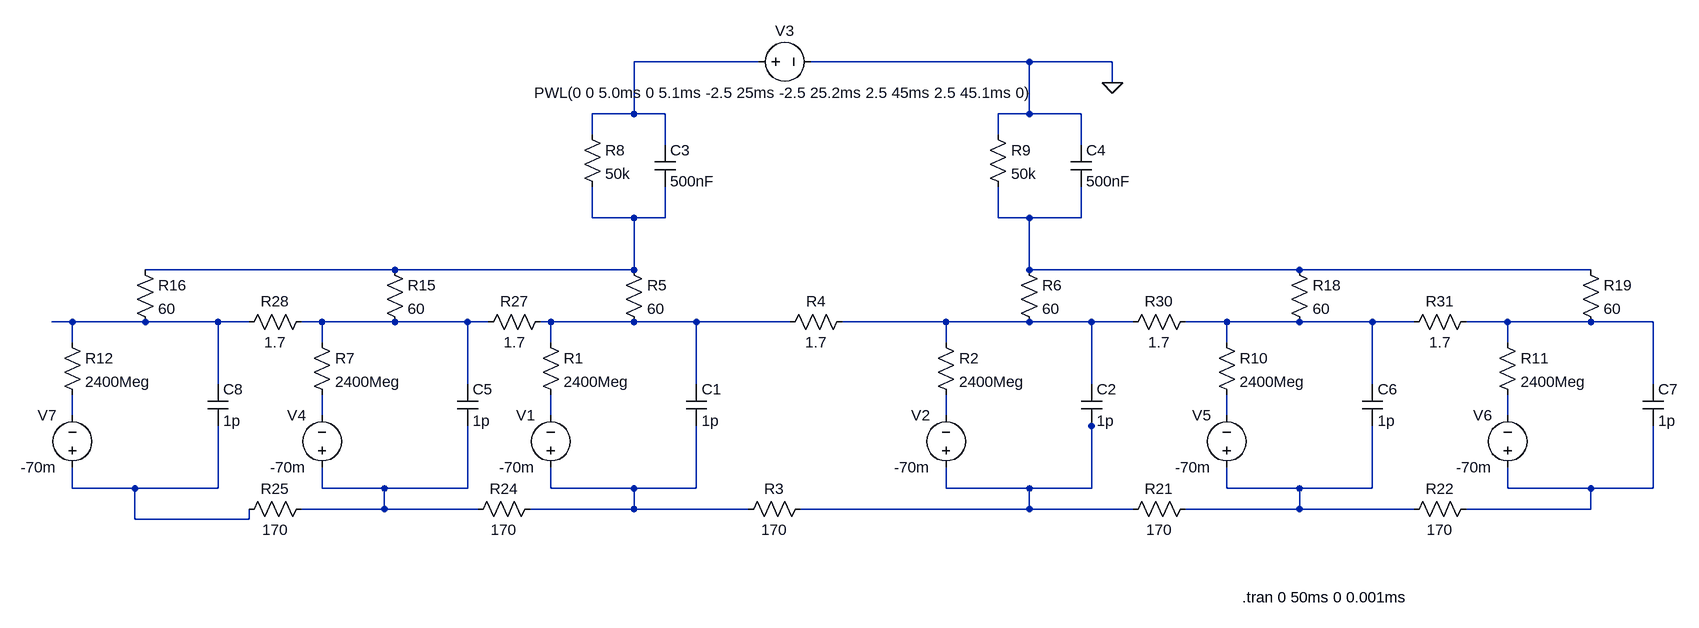
[diagram p0: schematic 電圧刺激等価回路_20200529.asc]
電圧刺激等価回路_20200529.asc, the LTspice schematic file:
Version 4
SHEET 1 2136 680
WIRE 320 -368 128 -368
WIRE 736 -368 400 -368
WIRE 864 -368 736 -368
WIRE 864 -336 864 -368
WIRE 128 -288 128 -368
WIRE 128 -288 64 -288
WIRE 176 -288 128 -288
WIRE 736 -288 736 -368
WIRE 736 -288 688 -288
WIRE 816 -288 736 -288
WIRE 64 -256 64 -288
WIRE 688 -256 688 -288
WIRE 176 -240 176 -288
WIRE 816 -240 816 -288
WIRE 64 -128 64 -176
WIRE 128 -128 64 -128
WIRE 176 -128 176 -176
WIRE 176 -128 128 -128
WIRE 688 -128 688 -176
WIRE 736 -128 688 -128
WIRE 816 -128 816 -176
WIRE 816 -128 736 -128
WIRE -240 -48 -624 -48
WIRE 128 -48 128 -128
WIRE 128 -48 -240 -48
WIRE 736 -48 736 -128
WIRE 1152 -48 736 -48
WIRE 1600 -48 1152 -48
WIRE -736 32 -768 32
WIRE -624 32 -736 32
WIRE -512 32 -624 32
WIRE -464 32 -512 32
WIRE -352 32 -384 32
WIRE -240 32 -352 32
WIRE -128 32 -240 32
WIRE -96 32 -128 32
WIRE 0 32 -16 32
WIRE 128 32 0 32
WIRE 224 32 128 32
WIRE 368 32 224 32
WIRE 608 32 448 32
WIRE 736 32 608 32
WIRE 832 32 736 32
WIRE 896 32 832 32
WIRE 1040 32 976 32
WIRE 1152 32 1040 32
WIRE 1264 32 1152 32
WIRE 1328 32 1264 32
WIRE 1472 32 1408 32
WIRE 1600 32 1472 32
WIRE 1696 32 1600 32
WIRE -736 64 -736 32
WIRE -352 64 -352 32
WIRE 0 64 0 32
WIRE 608 64 608 32
WIRE 1040 64 1040 32
WIRE 1472 64 1472 32
WIRE -512 128 -512 32
WIRE -128 128 -128 32
WIRE 224 128 224 32
WIRE 832 128 832 32
WIRE 1264 128 1264 32
WIRE 1696 128 1696 32
WIRE -736 176 -736 144
WIRE -352 176 -352 144
WIRE 0 176 0 144
WIRE 608 176 608 144
WIRE 1040 176 1040 144
WIRE 1472 176 1472 144
WIRE 832 192 832 176
WIRE -736 288 -736 256
WIRE -640 288 -736 288
WIRE -512 288 -512 192
WIRE -512 288 -640 288
WIRE -352 288 -352 256
WIRE -256 288 -352 288
WIRE -128 288 -128 192
WIRE -128 288 -256 288
WIRE 0 288 0 256
WIRE 128 288 0 288
WIRE 224 288 224 192
WIRE 224 288 128 288
WIRE 608 288 608 256
WIRE 736 288 608 288
WIRE 832 288 832 192
WIRE 832 288 736 288
WIRE 1040 288 1040 256
WIRE 1152 288 1040 288
WIRE 1264 288 1264 192
WIRE 1264 288 1152 288
WIRE 1472 288 1472 256
WIRE 1600 288 1472 288
WIRE 1696 288 1696 192
WIRE 1696 288 1600 288
WIRE -256 320 -256 288
WIRE -256 320 -384 320
WIRE -112 320 -256 320
WIRE 128 320 128 288
WIRE 128 320 -32 320
WIRE 304 320 128 320
WIRE 736 320 736 288
WIRE 736 320 384 320
WIRE 896 320 736 320
WIRE 1152 320 1152 288
WIRE 1152 320 976 320
WIRE 1328 320 1152 320
WIRE 1600 320 1600 288
WIRE 1600 320 1408 320
WIRE -640 336 -640 288
WIRE -464 336 -464 320
WIRE -464 336 -640 336
FLAG 864 -336 0
SYMBOL voltage 304 -368 R270
WINDOW 0 32 56 VTop 2
WINDOW 3 -32 56 VBottom 2
WINDOW 123 0 0 Left 0
WINDOW 39 0 0 Left 0
SYMATTR InstName V3
SYMATTR Value PWL(0 0 5.0ms 0 5.1ms -2.5 25ms -2.5 25.2ms 2.5 45ms 2.5 45.1ms 0)
SYMBOL res -16 48 R0
SYMATTR InstName R1
SYMATTR Value 2400Meg
SYMBOL res 592 48 R0
SYMATTR InstName R2
SYMATTR Value 2400Meg
SYMBOL res 400 304 R90
WINDOW 0 0 56 VBottom 2
WINDOW 3 32 56 VTop 2
SYMATTR InstName R3
SYMATTR Value 170
SYMBOL res 112 -64 R0
SYMATTR InstName R5
SYMATTR Value 60
SYMBOL res 720 -64 R0
SYMATTR InstName R6
SYMATTR Value 60
SYMBOL cap 208 128 R0
SYMATTR InstName C1
SYMATTR Value 1p
SYMBOL cap 816 128 R0
SYMATTR InstName C2
SYMATTR Value 1p
SYMBOL cap 160 -240 R0
SYMATTR InstName C3
SYMATTR Value 500nF
SYMBOL cap 800 -240 R0
SYMATTR InstName C4
SYMATTR Value 500nF
SYMBOL res 48 -272 R0
SYMATTR InstName R8
SYMATTR Value 50k
SYMBOL res 672 -272 R0
SYMATTR InstName R9
SYMATTR Value 50k
SYMBOL voltage 0 272 R180
WINDOW 0 24 96 Left 2
WINDOW 3 24 16 Left 2
SYMATTR InstName V1
SYMATTR Value -70m
SYMBOL voltage 608 272 R180
WINDOW 0 24 96 Left 2
WINDOW 3 24 16 Left 2
SYMATTR InstName V2
SYMATTR Value -70m
SYMBOL res 464 16 R90
WINDOW 0 0 56 VBottom 2
WINDOW 3 32 56 VTop 2
SYMATTR InstName R4
SYMATTR Value 1.7
SYMBOL res -368 48 R0
SYMATTR InstName R7
SYMATTR Value 2400Meg
SYMBOL cap -144 128 R0
SYMATTR InstName C5
SYMATTR Value 1p
SYMBOL voltage -352 272 R180
WINDOW 0 24 96 Left 2
WINDOW 3 24 16 Left 2
SYMATTR InstName V4
SYMATTR Value -70m
SYMBOL res 1024 48 R0
SYMATTR InstName R10
SYMATTR Value 2400Meg
SYMBOL cap 1248 128 R0
SYMATTR InstName C6
SYMATTR Value 1p
SYMBOL voltage 1040 272 R180
WINDOW 0 24 96 Left 2
WINDOW 3 24 16 Left 2
SYMATTR InstName V5
SYMATTR Value -70m
SYMBOL res 1456 48 R0
SYMATTR InstName R11
SYMATTR Value 2400Meg
SYMBOL cap 1680 128 R0
SYMATTR InstName C7
SYMATTR Value 1p
SYMBOL voltage 1472 272 R180
WINDOW 0 24 96 Left 2
WINDOW 3 24 16 Left 2
SYMATTR InstName V6
SYMATTR Value -70m
SYMBOL res -752 48 R0
SYMATTR InstName R12
SYMATTR Value 2400Meg
SYMBOL cap -528 128 R0
SYMATTR InstName C8
SYMATTR Value 1p
SYMBOL voltage -736 272 R180
WINDOW 0 24 96 Left 2
WINDOW 3 24 16 Left 2
SYMATTR InstName V7
SYMATTR Value -70m
SYMBOL res -256 -64 R0
SYMATTR InstName R15
SYMATTR Value 60
SYMBOL res -640 -64 R0
SYMATTR InstName R16
SYMATTR Value 60
SYMBOL res 1136 -64 R0
SYMATTR InstName R18
SYMATTR Value 60
SYMBOL res 1584 -64 R0
SYMATTR InstName R19
SYMATTR Value 60
SYMBOL res 992 304 R90
WINDOW 0 0 56 VBottom 2
WINDOW 3 32 56 VTop 2
SYMATTR InstName R21
SYMATTR Value 170
SYMBOL res 1424 304 R90
WINDOW 0 0 56 VBottom 2
WINDOW 3 32 56 VTop 2
SYMATTR InstName R22
SYMATTR Value 170
SYMBOL res -16 304 R90
WINDOW 0 0 56 VBottom 2
WINDOW 3 32 56 VTop 2
SYMATTR InstName R24
SYMATTR Value 170
SYMBOL res -368 304 R90
WINDOW 0 0 56 VBottom 2
WINDOW 3 32 56 VTop 2
SYMATTR InstName R25
SYMATTR Value 170
SYMBOL res 0 16 R90
WINDOW 0 0 56 VBottom 2
WINDOW 3 32 56 VTop 2
SYMATTR InstName R27
SYMATTR Value 1.7
SYMBOL res -368 16 R90
WINDOW 0 0 56 VBottom 2
WINDOW 3 32 56 VTop 2
SYMATTR InstName R28
SYMATTR Value 1.7
SYMBOL res 992 16 R90
WINDOW 0 0 56 VBottom 2
WINDOW 3 32 56 VTop 2
SYMATTR InstName R30
SYMATTR Value 1.7
SYMBOL res 1424 16 R90
WINDOW 0 0 56 VBottom 2
WINDOW 3 32 56 VTop 2
SYMATTR InstName R31
SYMATTR Value 1.7
TEXT 1064 456 Left 2 !.tran 0 50ms 0 0.001ms

The netlist it stands for:
* 電圧刺激等価回路_20200529.asc
V3 N001 0 PWL(0 0 5.0ms 0 5.1ms -2.5 25ms -2.5 25.2ms 2.5 45ms 2.5 45.1ms 0)
R1 N006 N012 2400Meg
R2 N007 N013 2400Meg
R3 N016 N019 170
R5 N002 N006 60
R6 N003 N007 60
C1 N006 N019 1p
C2 N007 N016 1p
C3 N001 N002 500nF
C4 0 N003 500nF
R8 N001 N002 50k
R9 0 N003 50k
V1 N019 N012 -70m
V2 N016 N013 -70m
R4 N007 N006 1.7
R7 N005 N011 2400Meg
C5 N005 N018 1p
V4 N018 N011 -70m
R10 N008 N014 2400Meg
C6 N008 N020 1p
V5 N020 N014 -70m
R11 N009 N015 2400Meg
C7 N009 N021 1p
V6 N021 N015 -70m
R12 N004 N010 2400Meg
C8 N004 N017 1p
V7 N017 N010 -70m
R15 N002 N005 60
R16 N002 N004 60
R18 N003 N008 60
R19 N003 N009 60
R21 N020 N016 170
R22 N021 N020 170
R24 N019 N018 170
R25 N018 N017 170
R27 N006 N005 1.7
R28 N005 N004 1.7
R30 N008 N007 1.7
R31 N009 N008 1.7
.tran 0 50ms 0 0.001ms
.backanno
.end